# EAGLE design trophy-v2.2-second (EAGLE 9.6.2)
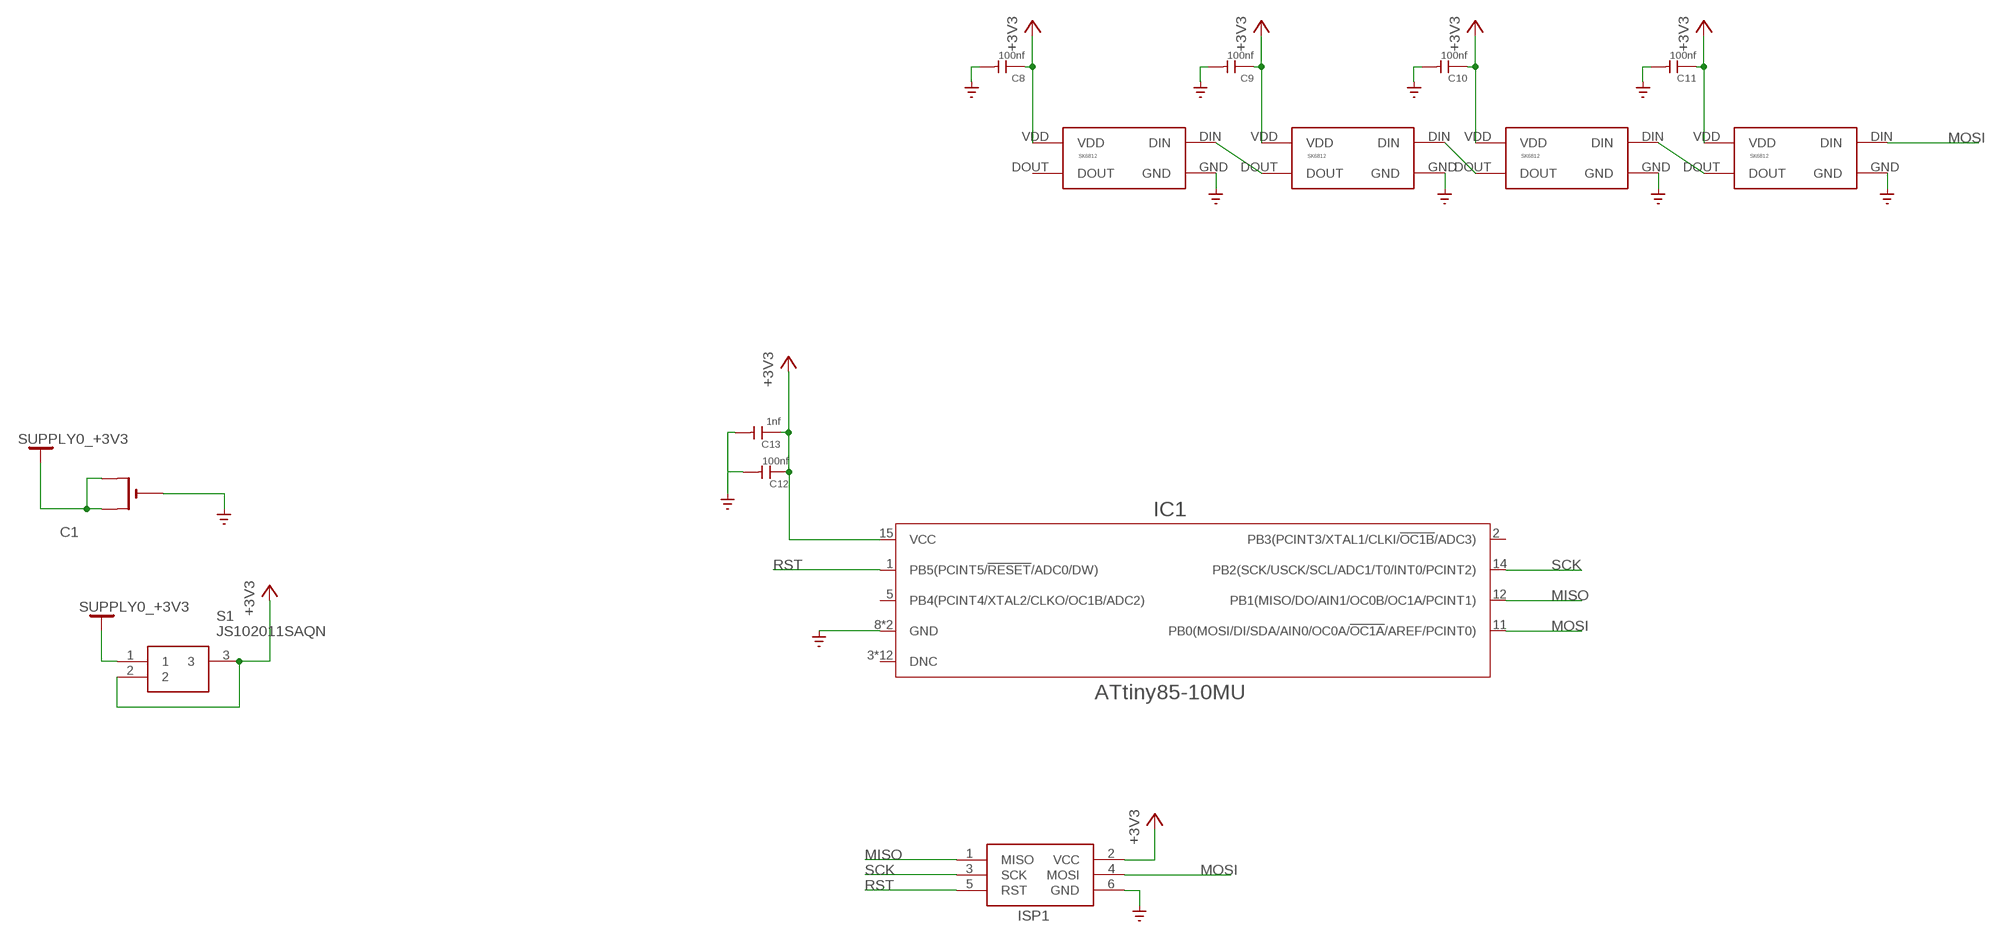
[diagram p0: schematic, sheet 1]

## Parts
C1  CL2020  CR2032SMT  [CR2032-SMD]
C8  100nf  CERAMIC-100NF-50V-10%-X7R(0603)  [C0603]
C9  100nf  CERAMIC-100NF-50V-10%-X7R(0603)  [C0603]
C10  100nf  CERAMIC-100NF-50V-10%-X7R(0603)  [C0603]
C11  100nf  CERAMIC-100NF-50V-10%-X7R(0603)  [C0603]
C12  100nf  CERAMIC-100NF-50V-10%-X7R(0603)  [C0603]
C13  1nf  CERAMIC-1NF-50V-5%-C0G(0603)  [C0603]
IC1  ATtiny85-10MU  ATTINY85-10MU-85_20PIN  [QFN50P400X400X80-21T275]
ISP1  AVRISP-6  [AVRISP]
S1  JS102011SAQN  [JS102011SAQN]
U$1  SK6812  [5050]
U$2  SK6812  [5050]
U$3  SK6812  [5050]
U$4  SK6812  [5050]

## Nets
+3V3: C8.1 C9.1 C10.1 C11.1 C12.1 C13.1 IC1.15(VCC) ISP1.2(VCC) S1.2 S1.3 U$1.VDD U$2.VDD U$3.VDD U$4.VDD
+3V3-BAT: C1.+$1(+) C1.+$2(+1) S1.1 ; supply symbol labelled SUPPLY0_+3V3
GND: C1.- C8.2 C9.2 C10.2 C11.2 C12.2 C13.2 IC1.8(GND) IC1.21(GND) ISP1.6(GND) U$1.GND U$2.GND U$3.GND U$4.GND ; supply symbol labelled SUPPLY0_GND_
MISO: IC1.12(PB1(MISO/DO/AIN1/OC0B/OC1A/PCINT1)) ISP1.1(MISO)
MOSI: IC1.11(PB0(MOSI/DI/SDA/AIN0/OC0A/!OC1A!/AREF/PCINT0)) ISP1.4(MOSI) U$1.DIN
N$8: U$3.DOUT U$4.DIN
N$9: U$2.DOUT U$3.DIN
N$10: U$1.DOUT U$2.DIN
RST: IC1.1(PB5(PCINT5/!RESET!/ADC0/DW)) ISP1.5(RST)
SCK: IC1.14(PB2(SCK/USCK/SCL/ADC1/T0/INT0/PCINT2)) ISP1.3(SCK)
Unconnected: IC1.2(PB3(PCINT3/XTAL1/CLKI/!OC1B!/ADC3)) IC1.3(DNC) IC1.4(DNC) IC1.5(PB4(PCINT4/XTAL2/CLKO/OC1B/ADC2)) IC1.6(DNC) IC1.7(DNC) IC1.9(DNC) IC1.10(DNC) IC1.13(DNC) IC1.16(DNC) IC1.17(DNC) IC1.18(DNC) IC1.19(DNC) IC1.20(DNC) U$4.DOUT

## Library data of the parts
C1 = adafruit:CR2032
C8-C12 = OPL_Capacitor:CERAMIC-100NF-50V-10%-X7R(0603): 302010138; MPN: CC0603KRX7R9BB104
C13 = OPL_Capacitor:CERAMIC-1NF-50V-5%-C0G(0603): 302010341; MPN: GRM1885C1H102JA01D
IC1 = IC_Embedded:ATTINY*-85_20PIN: Atmel tiny25/45/85, 8-bit AVR Microcontroller with 2/4/8K Bytes In-System Programmable Flash Datasheet <https://ww1.microchip.com/downloads/en/DeviceDoc/Atmel-2586-AVR-8-bit-Microcontroller-ATtiny25-ATtiny45-ATtiny85_Datasheet.pdf> Note:For this part User needs to add thermal via in thermal pad while designing a board.; CATEGORY: IC_Embedded; CORE: AVR; DESCRIPTION: AVR series Microcontroller IC 8-Bit 10MHz 8KB (4K x 16) FLASH 20-QFN-EP (4x4); MANUFACTURER: Microchip Technology; MPN: ATtiny85-10MU; OPERATING_TEMP: -40°C to 85°C; PART_STATUS: Active; ROHS_COMPLIANT: COMPLIANT; SERIES: ATtiny85; SPEED: 10MHz; SUB-CATEGORY: Microcontroller; TYPE: 8 Bit Microcontroller
ISP1 = adafruit:AVRISP: AVR ISP HEADER Standard 6 pin header for AVR programming
S1 = JS102011SAQN:JS102011SAQN: C & K COMPONENTS - JS102011SAQN - SWITCH, SPDT, 0.6A, 6VDC, SIDE, SMD Source: Datasheet <https://componentsearchengine.com//JS102011SAQN.pdf>; DESCRIPTION: C & K COMPONENTS - JS102011SAQN - SWITCH, SPDT, 0.6A, 6VDC, SIDE, SMD; HEIGHT: mm; MANUFACTURER_NAME: C & K COMPONENTS; MANUFACTURER_PART_NUMBER: JS102011SAQN; MOUSER2_PART_NUMBER: 611-JS102011SAQN; MOUSER2_PRICE-STOCK: https://www.mouser.com/Search/Refine.aspx?Keyword=611-JS102011SAQN
U$1-U$4 = smd_leds:SK6812

## Board
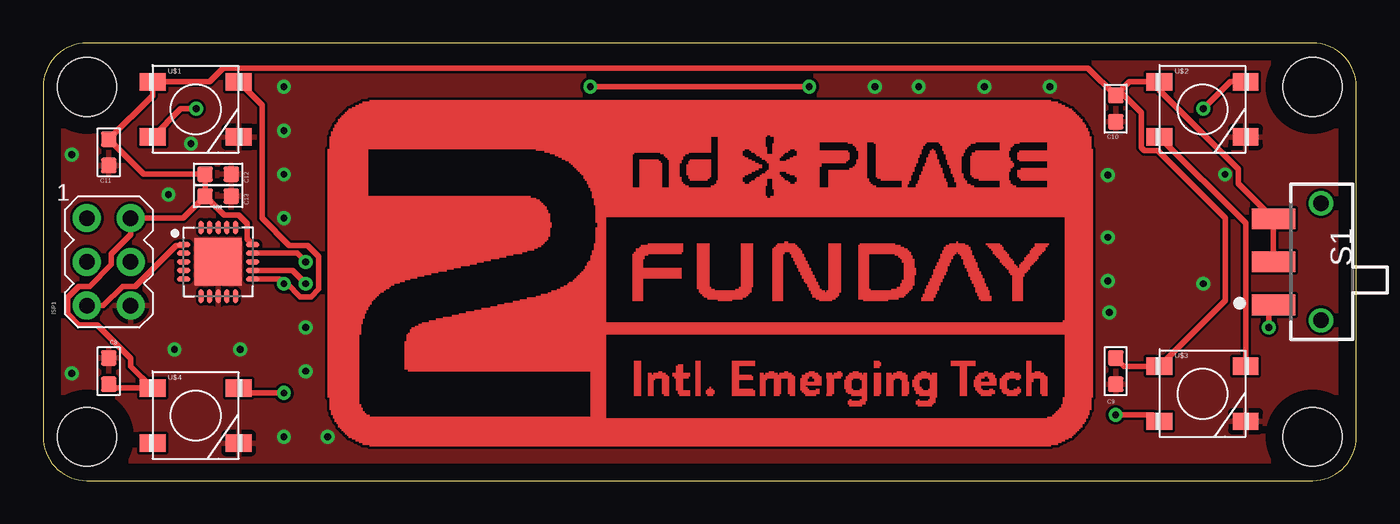
[diagram p1: board, top side]
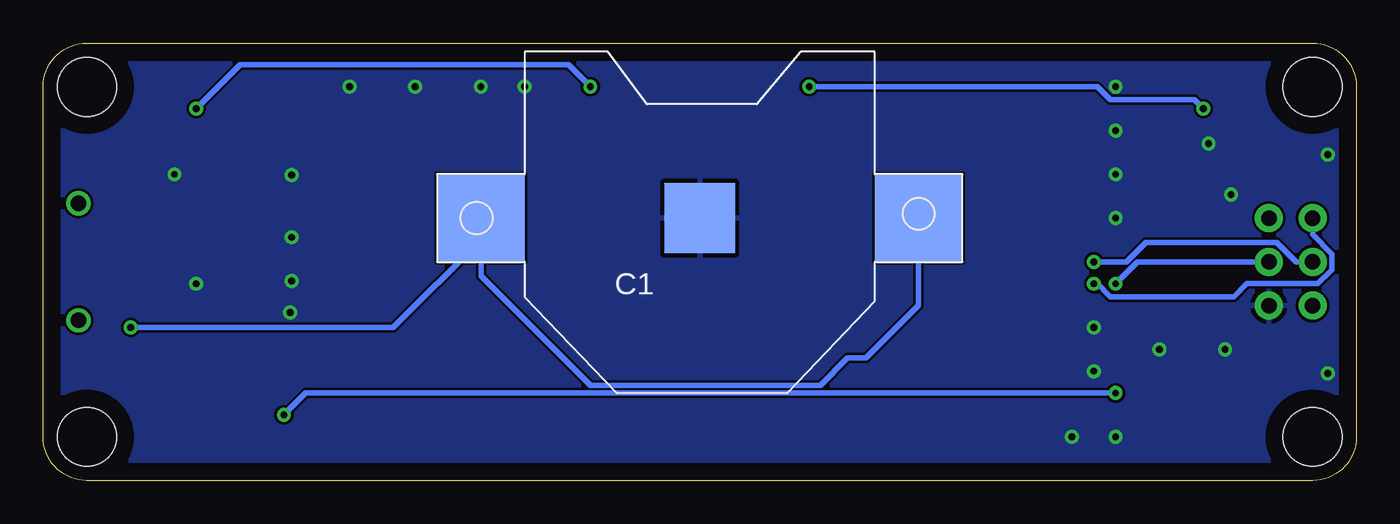
[diagram p2: board, bottom side, seen from below]

Size 76.2 x 25.4 mm. Coordinates in mm from the lower left corner, seen from the top.
Outline: 0,22.86 0,2.54 arc90 2.54,0 73.66,0 arc90 76.2,2.54 76.2,22.86 arc90 73.66,25.4 2.54,25.4 arc90 0,22.86
Copper layers (1*16): Top 0.035mm / dielectric 1.5mm / Bottom 0.035mm
Design rules "default": minimum track width 6mil, minimum drill 0.35mm, track to track 6mil, track to pad 6mil, pad to pad 6mil, via to via 6mil, smd to smd 6mil, copper to edge 40mil, drill to drill 6mil, minimum pad ring 10mil, minimum via ring 8mil, stop-mask expansion 4mil, vias tented up to drill 0mil, thermal gap 10mil
Holes 3.4 mm at 2.54,22.86 2.54,2.54 73.66,2.54 73.66,22.86

### Footprints (pad centres in the part's own frame; a part is rotated, then mirrored left to right if it is on the bottom)
CR2032-SMD = smd 5.08 x 5.08: +$1 -12.7,0; +$2 12.7,0 | smd 4.064 x 4.064: - 0,0
C0603 = smd 0.889 x 0.889: 1 0,0.762; 2 0,-0.762
QFN50P400X400X80-21T275 = smd 0.8 x 0.3: 1 -2,1; 2 -2,0.5; 3 -2,0; 4 -2,-0.5; 5 -2,-1; 11 2,-1; 12 2,-0.5; 13 2,0; 14 2,0.5; 15 2,1 | smd 0.3 x 0.8: 6 -1,-2; 7 -0.5,-2; 8 0,-2; 9 0.5,-2; 10 1,-2; 16 1,2; 17 0.5,2; 18 0,2; 19 -0.5,2; 20 -1,2 | smd 2.75 x 2.75: 21 0,0
AVRISP = drill 0.9 pad 1.626: 1 -1.27,2.54; 2 1.27,2.54; 3 -1.27,0; 4 1.27,0; 5 -1.27,-2.54; 6 1.27,-2.54
JS102011SAQN = smd 1.2 x 2.5: 1 -2.5,1; 2 0,1; 3 2.5,1 | drill 0.9 pad 1.4: 4 -3.4,-1.75; 5 3.4,-1.75
5050 = smd 1.5 x 1: DIN 5,4.1; DOUT 0,0.9; GND 5,0.9; VDD 0,4.1

### Placement (x,y rotation side)
C1  38.1,15.24 0 bottom
C8  3.81,6.35 180 top
C9  62.23,6.35 0 top
C10  62.23,21.59 0 top
C11  3.81,19.05 0 top
C12  10.16,17.78 90 top
C13  10.16,16.51 90 top
IC1  10.16,12.7 0 top
ISP1  3.81,12.7 0 top
S1  72.39,12.7 90 top
U$1  6.35,19.05 0 top
U$2  64.77,19.05 0 top
U$3  64.77,2.54 0 top
U$4  6.35,1.27 0 top

### Tracks (layer width: path | path; a pad name or v marks a point on that pad's centre or on a via)
+3V3
  Top 0.305: C8.1 4.03,5.37 U$4.VDD 5.08,6.64 5.08,7.1 3.13,9.04 2.08,9.04 1.42,9.7 1.42,10.62 2.08,11.28 2.7,11.28 3.96,12.54 3.96,13.16 5.08,14.28 ISP1.2 8.13,15.24 C13.1 | C9.1 62.7,6.64 U$3.VDD 68.58,10.45 68.58,15.24 64.67,19.14 63.89,19.14 63.72,19.32 63.72,21.38 62.48,22.61 | 62.48,22.61 C10.1 60.63,23.95 10.47,23.95 10.4,23.89 9.67,23.15 U$1.VDD 6.35,22.35 C11.1 5.84,17.78 C12.1 C13.1 | 62.48,22.61 63.03,23.15 U$2.VDD 64.77,22.66 69.34,18.09 69.34,17.25 S1.3 S1.2 | IC1.15 11.84,14.02 11.84,14.91 11.35,15.4 10.5,15.4 C13.1
+3V3-BAT  (via drill 0.4)
  Top 0.305: S1.1 71.12,9.93 v71.12,8.89
  Bottom 0.152: C1.+$1 50.8,13.97
  Bottom 0.305: v71.12,8.89 55.88,8.89 50.8,13.97 50.8,11.89 44.45,5.54 31.09,5.54 29.52,7.11 28.45,7.11 25.4,10.16 C1.+$2
GND  (via drill 0.4)
  other vias: 13.97,2.54 7.27,16.6 11.43,7.62 1.65,18.92 7.62,7.62 15.24,8.89 1.65,6.22 16.51,2.54 13.97,15.24 13.97,20.32 13.97,17.78 13.97,22.86 61.77,17.73 50.8,22.86 54.61,22.86 58.42,22.86 68.58,17.78 67.31,11.43 8.58,19.55 61.77,14.12 61.87,9.75 15.24,6.35 48.26,22.86 61.77,11.58
  pour Top: 0,22.86 0,2.54 arc90 2.54,0 73.66,0 arc90 76.2,2.54 76.2,22.86 arc90 73.66,25.4 2.54,25.4 arc90
  pour Bottom: 76.2,2.54 76.2,22.86 arc90 73.66,25.4 2.54,25.4 arc90 0,22.86 0,2.54 arc90 2.54,0 73.66,0 arc90
MISO  (via drill 0.4)
  Top 0.305: IC1.12 14.47,12.2 v15.24,11.43
  Bottom 0.305: v15.24,11.43 15.04,11.43 14.28,10.67 7.11,10.67 6.35,11.43 2.23,11.43 1.42,12.24 1.42,13.16 2.54,14.28 ISP1.1
MOSI  (via drill 0.4)
  Top 0.305: IC1.11 13.7,11.7 v13.97,11.43 14.17,11.43 14.93,10.67 15.55,10.67 16,11.12 16,13.01 15.36,13.66 14.28,13.66 12.7,15.24 12.7,21.8 U$1.DIN
  Bottom 0.305: ISP1.4 12.7,12.7 v13.97,11.43
N$8  (via drill 0.4)
  Top 0.305: U$4.DIN 11.64,5.08 v13.97,5.08 | v62.23,3.81 64.4,3.81 U$3.DOUT
  Bottom 0.305: v13.97,5.08 60.96,5.08 v62.23,3.81
N$9
  Top 0.305: U$2.DOUT 69.77,14.95 U$3.DIN
N$10  (via drill 0.4)
  Top 0.305: U$1.DOUT 7.99,21.59 v8.89,21.59 | v67.31,21.59 68.87,23.15 U$2.DIN | v44.45,22.86 v31.75,22.86
  Bottom 0.305: v67.31,21.59 64.77,24.13 45.72,24.13 v44.45,22.86 | v31.75,22.86 15.04,22.86 14.28,22.1 9.4,22.1 v8.89,21.59
RST
  Top 0.305: IC1.1 8.12,13.65 7.72,13.65 5.34,11.28 4.62,11.28 3.5,10.16 ISP1.5
SCK  (via drill 0.4)
  Top 0.305: IC1.14 14.74,13.2 v15.24,12.7
  Bottom 0.305: v15.24,12.7 13.35,12.7 12.23,13.82 4.62,13.82 3.5,12.7 ISP1.3
(copper drawn outside any net)
  shapes: Top area x1454